# EAGLE design HabTrackerPiZero_Shield (EAGLE 9.4.2)
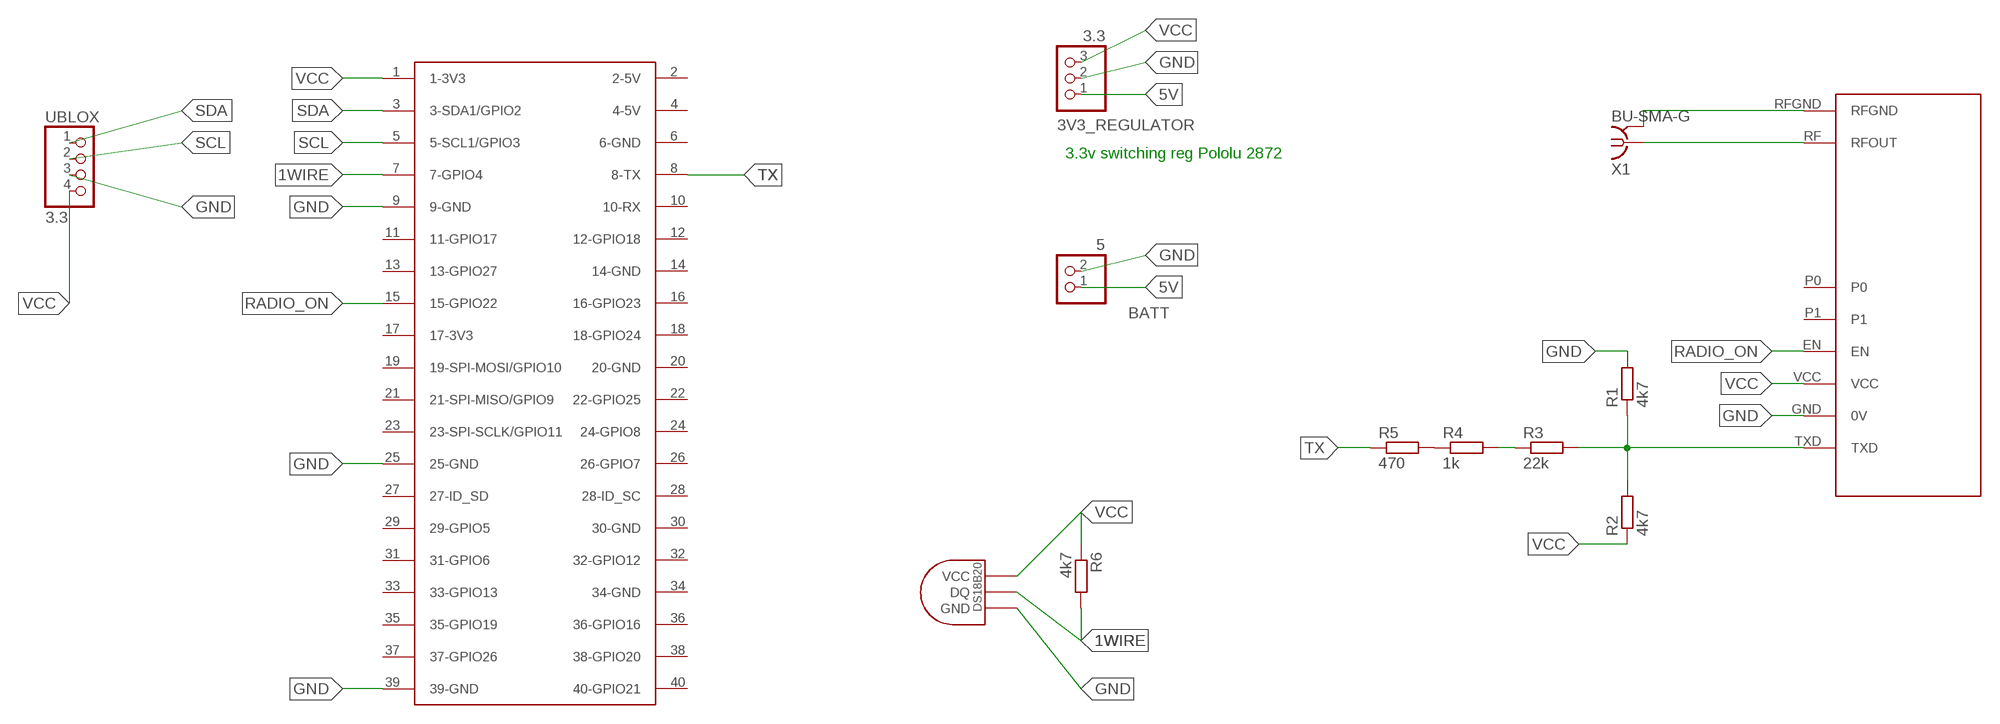
[diagram p0: schematic, sheet 1]

## Parts
3V3_REGULATOR  3.3  PINHD-1X3  [1X03]
BATT  5  PINHD-1X2  [1X02]
R1  4k7  R-EU_0204/7  [0204/7]
R2  4k7  R-EU_0204/7  [0204/7]
R3  22k  R-EU_0204/7  [0204/7]
R4  1k  R-EU_0204/7  [0204/7]
R5  470  R-EU_0204/7  [0204/7]
R6  4k7  R-EU_0204/7  [0204/7]
U$1  RASPBERRY-PI+PIZERO  [RASPBERRY-PI-ZERO]
U$2  DS1820TO92  [DS1820]
U$3  RADIOMETRIX-MTX2  [RADIOMETRIX-MTX2]
UBLOX  3.3  PINHD-1X4  [1X04]
X1  BU-SMA-G  [BU-SMA-G]

## Nets
1WIRE: R6.2 U$1.7(7-GPIO4) U$2.DQ
5V: 3V3_REGULATOR.1 BATT.1
GND: 3V3_REGULATOR.2 BATT.2 R1.2 U$1.9(9-GND) U$1.25(25-GND) U$1.39(39-GND) U$2.GND U$3.GND(0V) UBLOX.3
N$1: R1.1 R2.2 R3.2 U$3.TXD
N$4: U$3.RF(RFOUT) X1.1
N$5: U$3.RFGND X1.2 X1.3 X1.4 X1.5
N$7: R4.1 R5.2
N$8: R3.1 R4.2
RADIO_ON: U$1.15(15-GPIO22) U$3.EN
SCL: U$1.5(5-SCL1/GPIO3) UBLOX.2
SDA: U$1.3(3-SDA1/GPIO2) UBLOX.1
TX: R5.1 U$1.8(8-TX)
VCC: 3V3_REGULATOR.3 R2.1 R6.1 U$1.1(1-3V3) U$2.VDD(VCC) U$3.VCC UBLOX.4
Unconnected: U$1.2(2-5V) U$1.4(4-5V) U$1.6(6-GND) U$1.10(10-RX) U$1.11(11-GPIO17) U$1.12(12-GPIO18) U$1.13(13-GPIO27) U$1.14(14-GND) U$1.16(16-GPIO23) U$1.17(17-3V3) U$1.18(18-GPIO24) U$1.19(19-SPI-MOSI/GPIO10) U$1.20(20-GND) U$1.21(21-SPI-MISO/GPIO9) U$1.22(22-GPIO25) U$1.23(23-SPI-SCLK/GPIO11) U$1.24(24-GPIO8) U$1.26(26-GPIO7) U$1.27(27-ID_SD) U$1.28(28-ID_SC) U$1.29(29-GPIO5) U$1.30(30-GND) U$1.31(31-GPIO6) U$1.32(32-GPIO12) U$1.33(33-GPIO13) U$1.34(34-GND) U$1.35(35-GPIO19) U$1.36(36-GPIO16) U$1.37(37-GPIO26) U$1.38(38-GPIO20) U$1.40(40-GPIO21) U$3.P0 U$3.P1

## Notes on the sheet
- 3.3v switching reg Pololu 2872

## Library data of the parts
3V3_REGULATOR = pinhead:PINHD-1X3: PIN HEADER
BATT = pinhead:PINHD-1X2: PIN HEADER
R1-R6 = rcl:R-EU_: RESISTOR, European symbol; SPICEPREFIX: R
U$1 = Ava_mod:RASPBERRY-PI+: Samtec SSW-120-01-T-D
U$2 = Ava:DS1820: DS18B20 Programmable Resolution 1-Wire Digital Thermometer Description The DS18B20 digital thermometer provides 9-bit to 12-bit Celsius temperature measurements and has an alarm function with nonvolatile user-programmable upper and lower trigger points. The DS18B20 communicates over a 1-Wire® bus that by definition requires only one data line (and ground) for communication with a central microprocessor. It has an operating temperature range of -55°C to +125°C and is accurate to ±0.5°C over the range of -10°C to +85°C. In addition, the DS18B20 can derive power directly from the data line ("parasite power"), eliminating the need for an external power supply. Each DS18B20 has a unique 64-bit serial code, which allows multiple DS18B20s to function on the same 1-Wire bus. Thus, it is simple to use one microprocessor to control many DS18B20s distributed over a large area. Applications that can benefit from this feature include HVAC environmental controls, temperature monitoring systems inside buildings, equipment, or machinery, and process monitoring and control systems.
U$3 = Ava:RADIOMETRIX-MTX2; OC_FARNELL: unknown
UBLOX = pinhead:PINHD-1X4: PIN HEADER
X1 = con-coax:BU-SMA-G: FEMALE SMA CONNECTOR Radiall distributor RS 193-9117; OC_FARNELL: unknown; OC_NEWARK: unknown

## Net classes
0 default: width 0.508 mm, drill 0.762 mm, clearance 0.305 mm

## Board
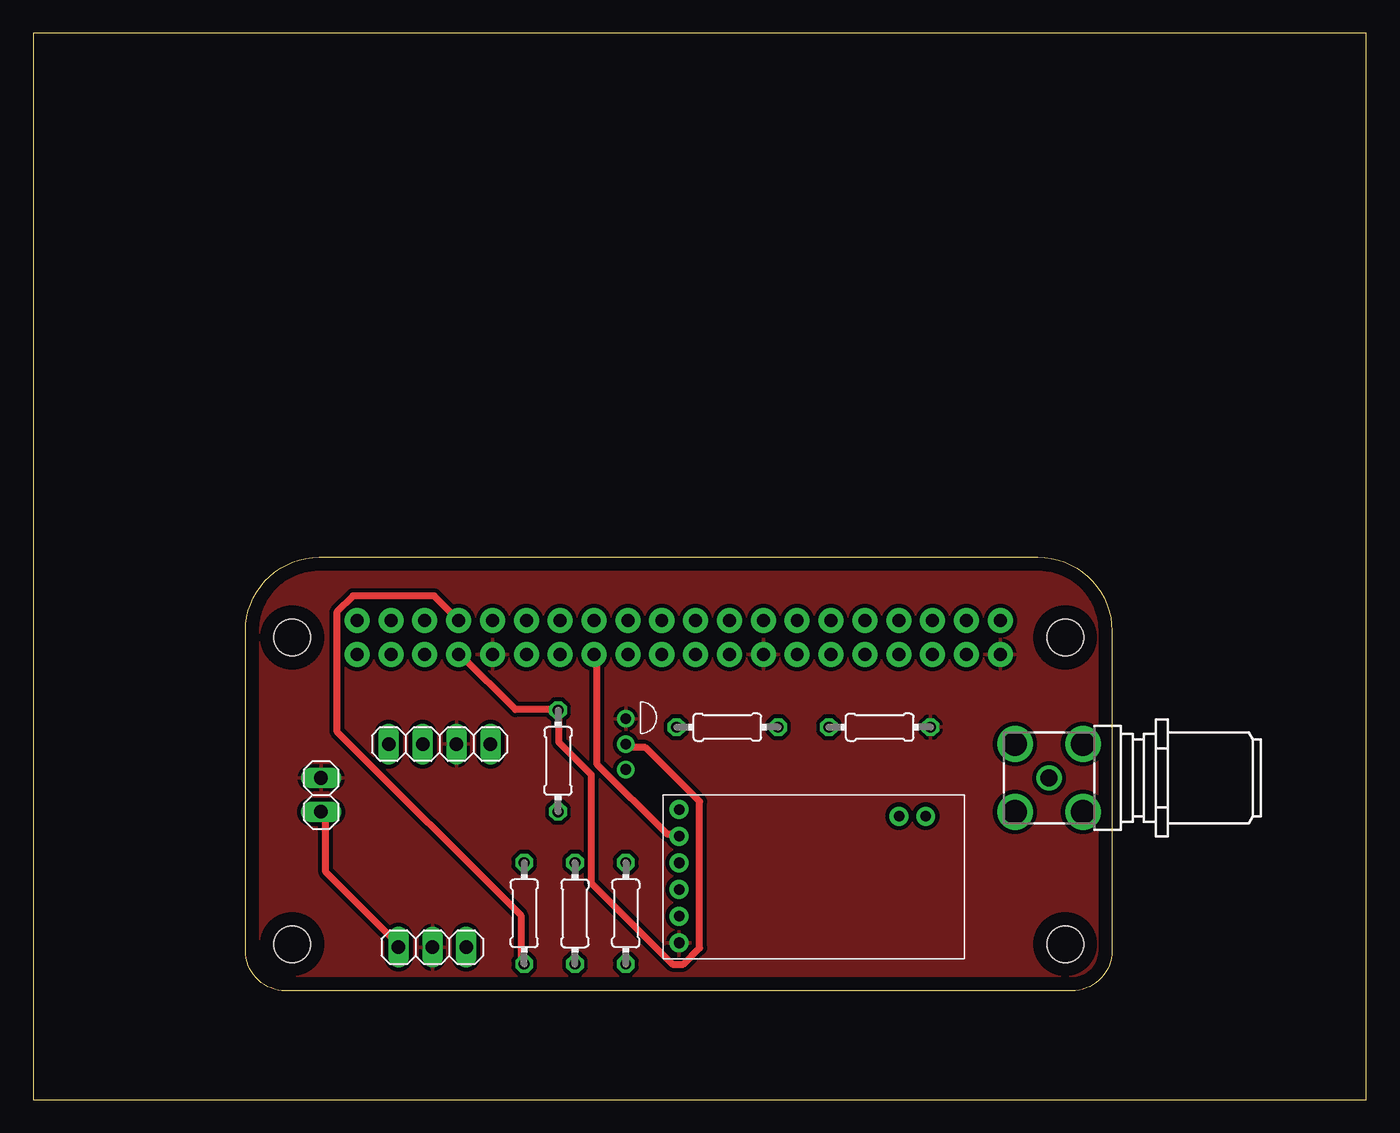
[diagram p1: board, top side]
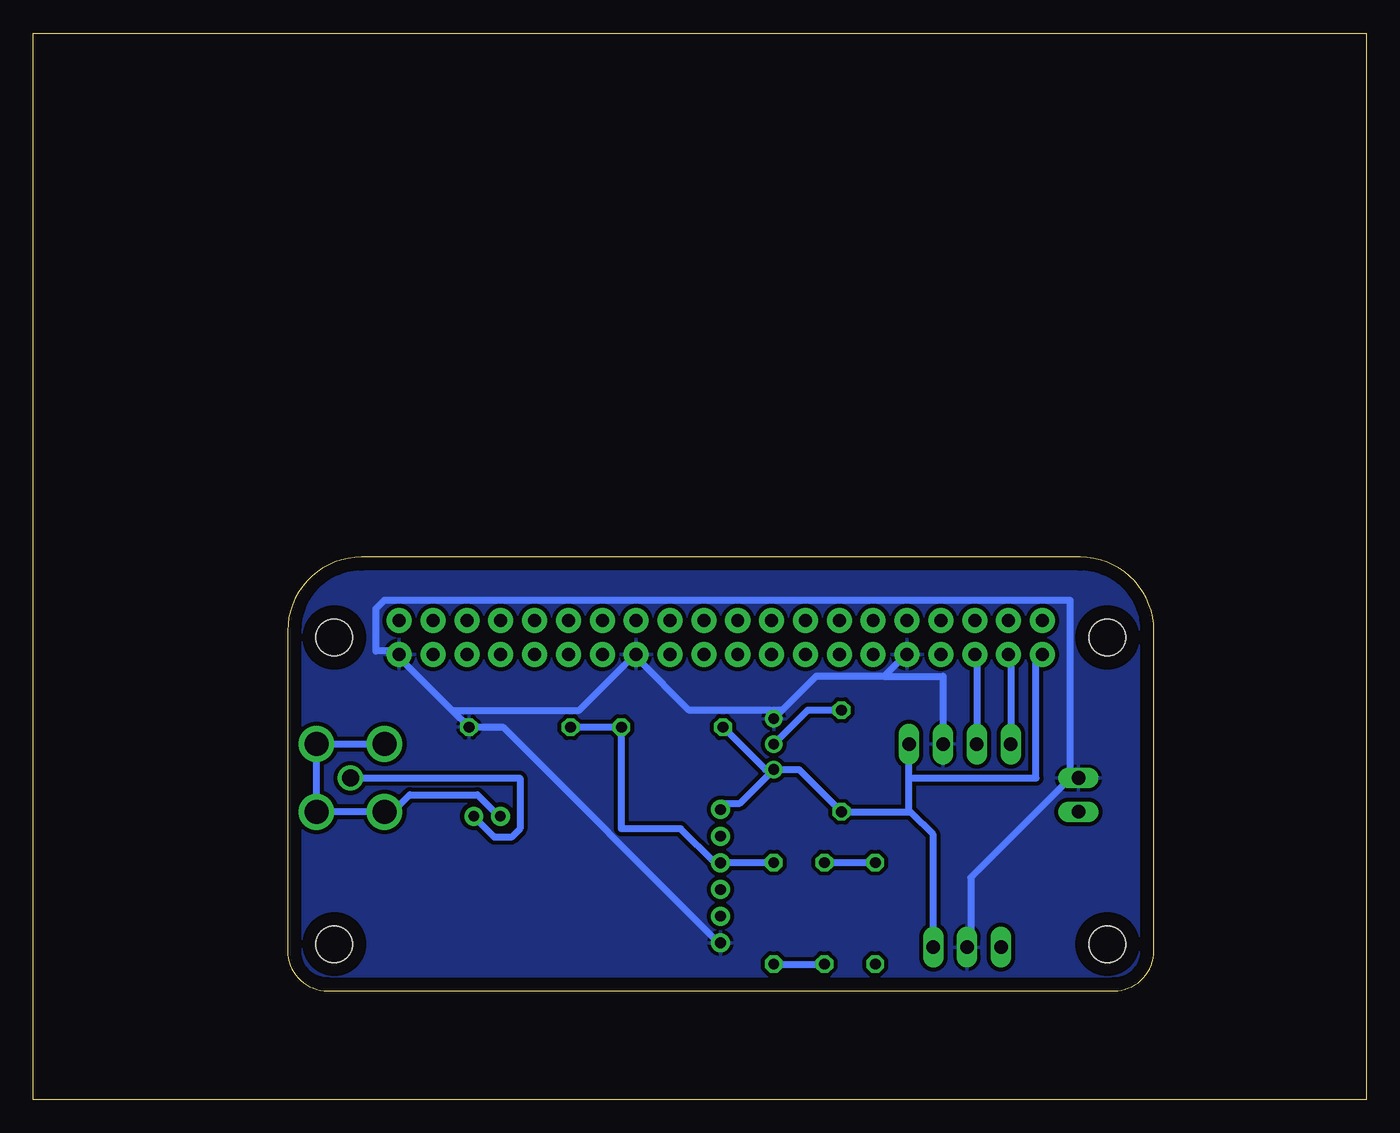
[diagram p2: board, bottom side, seen from below]

Size 100 x 80 mm. Coordinates in mm from the lower left corner, seen from the top.
Outline: 0,0 100,0 100,80 0,80 0,0
Copper layers (1*16): Top 0.035mm / dielectric 1.5mm / Bottom 0.035mm
Design rules "default": minimum track width 6mil, minimum drill 0.35mm, track to track 6mil, track to pad 6mil, pad to pad 6mil, via to via 6mil, smd to smd 6mil, copper to edge 40mil, drill to drill 6mil, minimum pad ring 10mil, minimum via ring 8mil, stop-mask expansion 4mil, vias tented up to drill 0mil, thermal gap 10mil

### Footprints (pad centres in the part's own frame; a part is rotated, then mirrored left to right if it is on the bottom)
1X03 = drill 1.016 long: 1 -2.54,0; 2 0,0; 3 2.54,0
1X02 = drill 1.016 long: 1 -1.27,0; 2 1.27,0
0204/7 = drill 0.813 octagon: 1 -3.81,0; 2 3.81,0
RASPBERRY-PI-ZERO = drill 0.97 pad 1.88: 1 -23.97,23.23; 2 -23.97,25.77; 3 -21.43,23.23; 4 -21.43,25.77; 5 -18.89,23.23; 6 -18.89,25.77; 7 -16.35,23.23; 8 -16.35,25.77; 9 -13.81,23.23; 10 -13.81,25.77; 11 -11.27,23.23; 12 -11.27,25.77; 13 -8.73,23.23; 14 -8.73,25.77; 15 -6.19,23.23; 16 -6.19,25.77; 17 -3.65,23.23; 18 -3.65,25.77; 19 -1.11,23.23; 20 -1.11,25.77; 21 1.43,23.23; 22 1.43,25.77; 23 3.97,23.23; 24 3.97,25.77; 25 6.51,23.23; 26 6.51,25.77; 27 9.05,23.23; 28 9.05,25.77; 29 11.59,23.23; 30 11.59,25.77; 31 14.13,23.23; 32 14.14,25.77; 33 16.67,23.23; 34 16.67,25.77; 35 19.21,23.23; 36 19.21,25.77; 37 21.75,23.23; 38 21.75,25.77; 39 24.29,23.23; 40 24.29,25.77 | hole 2.75: -28.84,24.5; 29.16,24.5; -28.84,1.5; 29.16,1.5
DS1820 = drill 0.8: DQ 2.54,-1.27; GND 0.635,-1.27; VDD 4.445,-1.27
RADIOMETRIX-MTX2 = drill 0.8 pad 1.422: EN 9.97,-3.25; GND 9.97,4.75; P0 9.97,2.75; P1 9.97,0.75; RF -8.53,-4.75; RFGND -6.53,-4.75; TXD 9.97,-1.25; VCC 9.97,-5.25
1X04 = drill 1.016 long: 1 -3.81,0; 2 -1.27,0; 3 1.27,0; 4 3.81,0
BU-SMA-G = drill 1.27: 1 0,0 | drill 1.778: 2 -2.55,2.55; 3 2.55,2.55; 4 2.55,-2.55; 5 -2.55,-2.55

### Placement (x,y rotation side)
3V3_REGULATOR  29.94,11.43 0 top
BATT  21.59,22.86 90 top
R1  63.5,27.94 0 top
R2  52.07,27.94 0 top
R3  44.45,13.97 90 top
R4  40.64,13.97 270 top
R5  36.83,13.97 90 top
R6  39.37,25.4 90 top
U$1  48.26,10.16 0 top
U$2  45.72,29.21 270 top
U$3  58.42,16.51 180 top
UBLOX  30.48,26.67 0 top
X1  76.2,24.13 0 top

### Tracks (layer width: path | path; a pad name or v marks a point on that pad's centre or on a via)
1WIRE
  Top 0.508: U$2.DQ 44.7,26.42 45.92,26.42 49.99,22.35 49.99,11.38 48.77,10.16 47.95,10.16 41.86,16.26 41.86,24.38 39.42,26.82 39.42,28.85 R6.2 39.01,29.26 36.17,29.26 32.11,33.33 U$1.7
  Bottom 0.508: U$2.DQ 41.91,29.21 R6.2
5V
  Top 0.508: BATT.1 21.95,21.54 21.95,17.07 27.23,11.79 3V3_REGULATOR.1
GND
  Bottom 0.508: 43.81,29.21 41.27,31.75 36.2,31.75 | 43.81,29.21 U$2.GND | 36.2,31.75 34.92,33.02 U$1.9 | UBLOX.3 31.75,31.75 36.2,31.75 | 43.81,29.21 50.8,29.21 54.61,33.02 U$1.25 55.24,33.02 59.05,29.21 68.58,29.21 | 68.58,29.21 72.39,33.02 U$1.39 73.03,33.66 74.3,33.66 74.3,36.83 73.66,37.47 22.23,37.47 22.23,24.13 BATT.2 22.35,23.98 29.67,16.66 29.67,11.79 3V3_REGULATOR.2 | 68.58,29.21 R1.2 64.77,27.94 48.9,12.06 U$3.GND
  pour Top: 15,42 15,7 82,7 82,42
  pour Bottom: 14,43 14,6 83,6 83,43
N$1
  Bottom 0.508: R1.1 R2.2 55.88,20.32 51.44,20.32 48.9,17.78 U$3.TXD 48.26,17.78 R3.2
N$4
  Bottom 0.508: X1.1 63.5,24.13 63.5,20.32 64.14,19.68 65.41,19.68 66.67,20.95 U$3.RF
N$5
  Bottom 0.508: X1.3 X1.2 | U$3.RFGND 65.41,21.59 66.67,22.86 71.75,22.86 73.03,21.59 X1.5 X1.4 | X1.4 X1.3 | X1.3 | X1.4
N$7
  Bottom 0.508: R4.1 R5.2
N$8
  Bottom 0.508: R3.1 R4.2
RADIO_ON
  Top 0.508: U$3.EN 48.36,19.91 47.55,19.91 42.27,25.2 42.27,33.33 U$1.15
SCL
  Bottom 0.508: UBLOX.2 29.21,33.02 U$1.5
SDA
  Bottom 0.508: UBLOX.1 26.67,33.02 U$1.3
TX
  Top 0.508: R5.1 36.58,10.16 36.58,13.82 22.76,27.64 22.76,36.58 23.98,37.8 30.07,37.8 31.7,36.17 U$1.8
VCC
  Bottom 0.508: U$2.VDD 46.99,22.23 48.26,22.23 U$3.VCC | U$2.VDD 42.55,24.77 R6.1 34.29,21.59 | R2.1 45.09,24.77 U$2.VDD | 34.29,21.59 34.29,24.13 | 34.29,24.13 UBLOX.4 | 34.29,24.13 24.77,24.13 24.77,33.02 U$1.1 | 3V3_REGULATOR.3 32.51,11.79 32.51,19.91 34.14,21.54 34.29,21.59

### Text on the board
tValues: SDA | SCL | GND | VCC | Batt- | Batt+